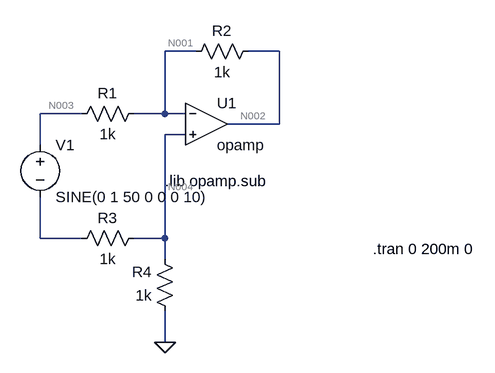
[diagram p0: schematic Draft2.asc]
Draft2.asc, the LTspice schematic file:
Version 4
SHEET 1 880 680
WIRE 208 48 160 48
WIRE 336 48 288 48
WIRE 32 144 -32 144
WIRE 160 144 160 48
WIRE 160 144 112 144
WIRE 192 144 160 144
WIRE 336 160 336 48
WIRE 336 160 256 160
WIRE 192 176 160 176
WIRE -32 192 -32 144
WIRE -32 336 -32 272
WIRE 32 336 -32 336
WIRE 160 336 160 176
WIRE 160 336 112 336
WIRE 160 368 160 336
WIRE 160 496 160 448
FLAG 160 496 0
SYMBOL OpAmps\\opamp 224 96 R0
SYMATTR InstName U1
SYMBOL voltage -32 176 R0
WINDOW 123 0 0 Left 0
WINDOW 39 0 0 Left 0
SYMATTR InstName V1
SYMATTR Value SINE(0 1 50 0 0 0 10)
SYMBOL res 128 128 R90
WINDOW 0 0 56 VBottom 2
WINDOW 3 32 56 VTop 2
SYMATTR InstName R1
SYMATTR Value 1k
SYMBOL res 304 32 R90
WINDOW 0 0 56 VBottom 2
WINDOW 3 32 56 VTop 2
SYMATTR InstName R2
SYMATTR Value 1k
SYMBOL res 128 320 R90
WINDOW 0 0 56 VBottom 2
WINDOW 3 32 56 VTop 2
SYMATTR InstName R3
SYMATTR Value 1k
SYMBOL res 176 464 R180
WINDOW 0 36 76 Left 2
WINDOW 3 36 40 Left 2
SYMATTR InstName R4
SYMATTR Value 1k
TEXT 160 248 Left 2 !.lib opamp.sub
TEXT 480 352 Left 2 !.tran 0 200m 0

The netlist it stands for:
* Draft2.asc
XU1 N001 N004 N002 opamp Aol=100K GBW=10Meg  ; pins invin noninvin out
V1 N003 N005 SINE(0 1 50 0 0 0 10)
R1 N001 N003 1k
R2 N002 N001 1k
R3 N004 N005 1k
R4 0 N004 1k
.lib opamp.sub
.tran 0 200m 0
.backanno
.end

* Results of the author's LTspice run, read from the files saved beside the schematic
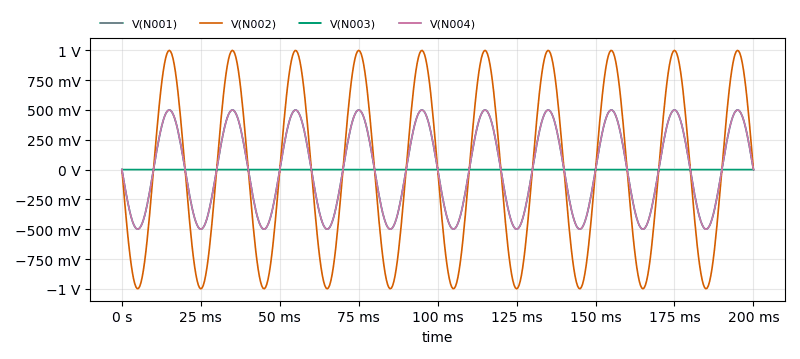
[diagram p1: Transient Analysis of Draft2.asc, plotted from the saved traces]
* Transient Analysis, 1 run:
*   V(N001): min -499.5 mV, max 499.5 mV, average 361.4 nV, rms 353.2 mV, last 7.497 µV
*   V(N002): min -999 mV, max 999 mV, average 722.3 nV, rms 706.5 mV, last 9.996 µV
*   V(N003): min -11.19 µV, max 11.19 µV, average -150 pV, rms 7.91 µV, last 4.998 µV
*   V(N004): min -499.5 mV, max 499.5 mV, average 361.3 nV, rms 353.2 mV, last 2.499 µV